# EAGLE schematic untitled (EAGLE 7.3.0)
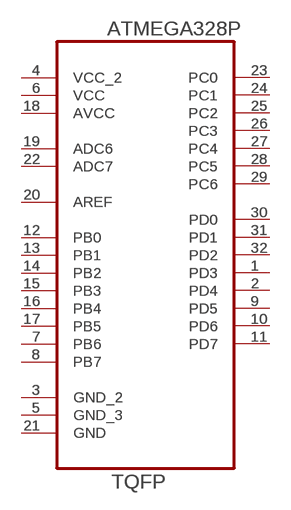
[diagram p0: schematic, sheet 1]

## Parts
U1  ATMEGA328P-AU  [QFP80P900X900X120-32N]
U2  ATMEGA328P-AU  [QFP80P900X900X120-32N]

## Nets
N$1: U1.4(VCC_2) U2.4(VCC_2)
N$2: U1.6(VCC) U2.6(VCC)
N$3: U1.18(AVCC) U2.18(AVCC)
N$4: U1.19(ADC6) U2.19(ADC6)
N$5: U1.22(ADC7) U2.22(ADC7)
N$6: U1.20(AREF) U2.20(AREF)
N$7: U1.12(PB0) U2.12(PB0)
N$8: U1.13(PB1) U2.13(PB1)
N$9: U1.14(PB2) U2.14(PB2)
N$10: U1.15(PB3) U2.15(PB3)
N$11: U1.16(PB4) U2.16(PB4)
N$12: U1.17(PB5) U2.17(PB5)
N$13: U1.7(PB6) U2.7(PB6)
N$14: U1.8(PB7) U2.8(PB7)
N$15: U1.3(GND_2) U2.3(GND_2)
N$16: U1.5(GND_3) U2.5(GND_3)
N$17: U1.21(GND) U2.21(GND)
N$18: U1.23(PC0) U2.23(PC0)
N$19: U1.24(PC1) U2.24(PC1)
N$20: U1.25(PC2) U2.25(PC2)
N$21: U1.26(PC3) U2.26(PC3)
N$22: U1.27(PC4) U2.27(PC4)
N$23: U1.28(PC5) U2.28(PC5)
N$24: U1.29(PC6) U2.29(PC6)
N$25: U1.30(PD0) U2.30(PD0)
N$26: U1.31(PD1) U2.31(PD1)
N$27: U1.32(PD2) U2.32(PD2)
N$28: U1.1(PD3) U2.1(PD3)
N$29: U1.2(PD4) U2.2(PD4)
N$30: U1.9(PD5) U2.9(PD5)
N$31: U1.10(PD6) U2.10(PD6)
N$32: U1.11(PD7) U2.11(PD7)

## Library data of the parts
U1 U2 = Ava:ATMEGA328P-AU; DESCRIPTION: 8-bit Microcontroller with In-System Programmable Flash; MPN: ATMEGA328P-AU; OC_FARNELL: 1715486; OC_NEWARK: 14R4631; PACKAGE: TQFP-32; SUPPLIER: Atmel